# EasyEDA Pro project Cerebro.epro

# Schematic Schematic1
Board Name: ESP-central; Create Date: 2025-05-28; Page Name: P1; Project Name: Sansone; Schematic Name: Schematic1; Update Date: 2025-10-13; Company: EasyEDA.com; Drawn: Maximo Huykman; Page Size: A4; Reviewed: Maximo Huykman; Version: V1.0
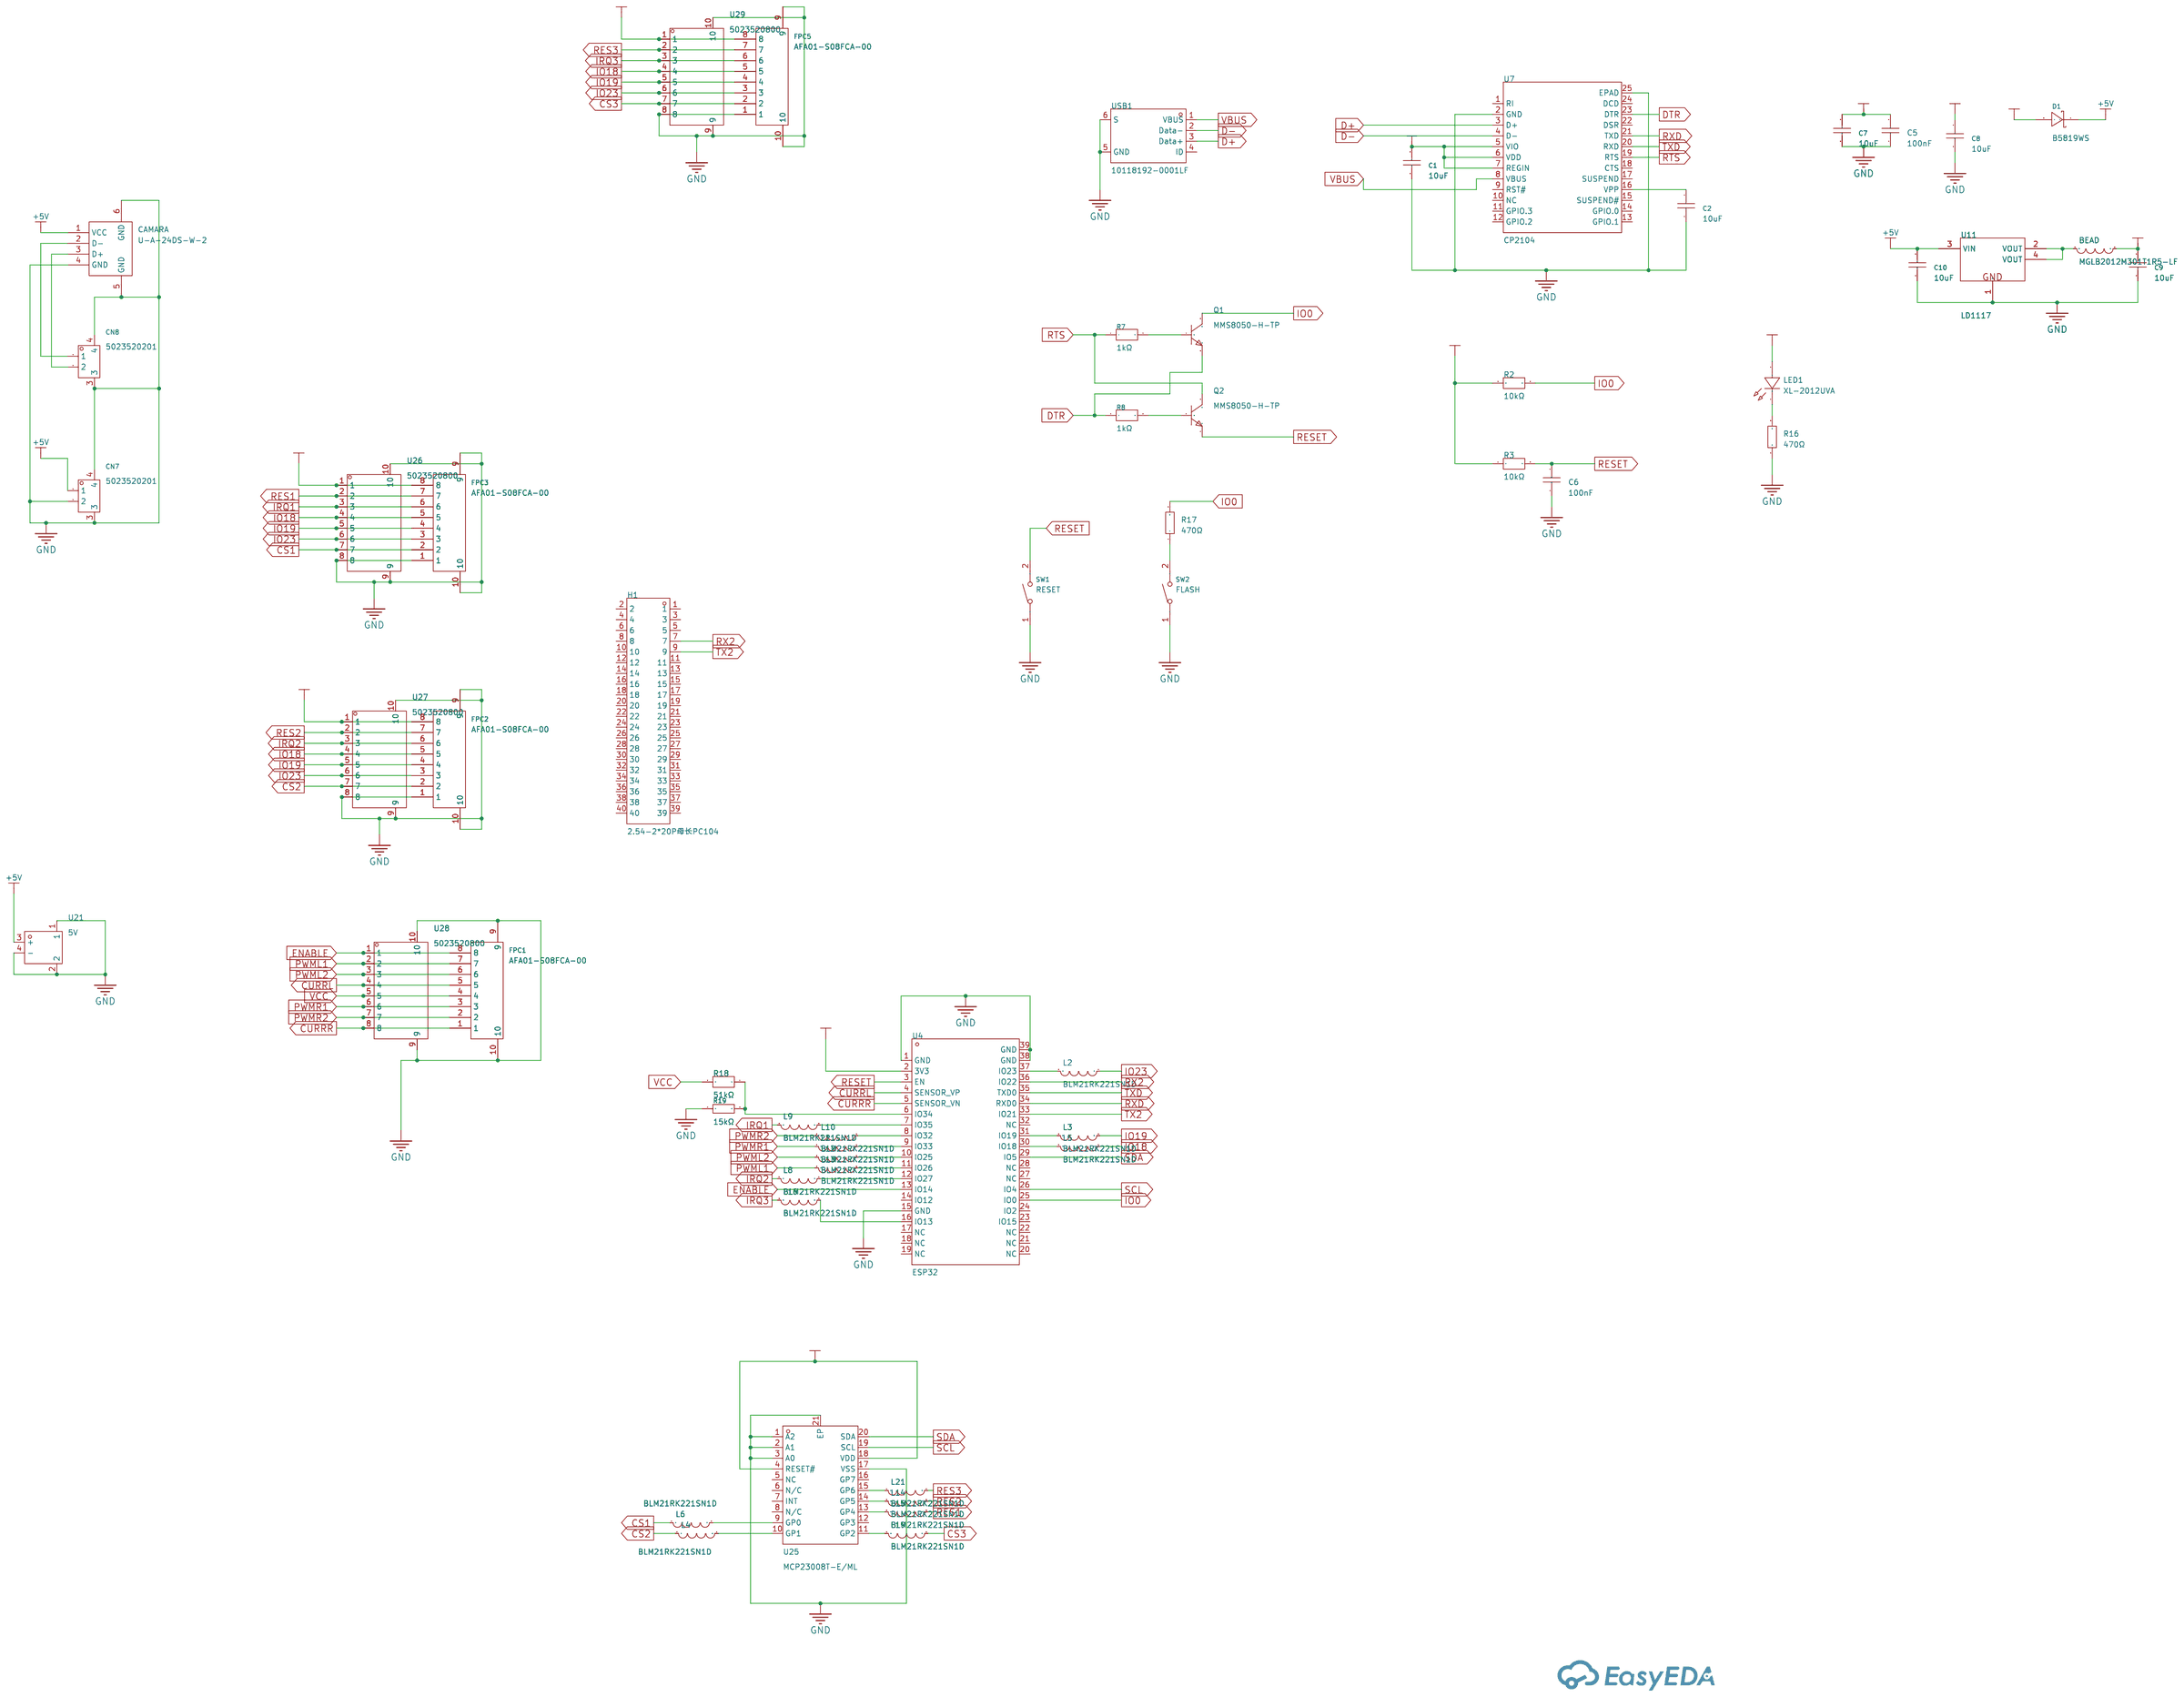
[diagram p0: schematic sheet]

## Parts
BEAD  MGLB2012M301T1R5-LF  [L0805]
C1  10uF  [C0805]
C2  10uF  [C0805]
C5  100nF  [C0805]
C6  100nF  [C0805]
C7  10uF  [C0805]
C8  10uF  [C0805]
C9  10uF  [C0805]
C10  10uF  [C0805]
CAMARA  U-A-24DS-W-2  [USB-A-SMD_U-A-24DS-Y-1]
CN7  5023520201  [CONN-SMD_2P-P2.00_MOLEX_5023520201]
CN8  5023520201  [CONN-SMD_2P-P2.00_MOLEX_5023520201]
D1  B5819WS  [SOD-323_L1.8-W1.3-LS2.5-RD]
FPC1  AFA01-S08FCA-00  [FPC-SMD_8P-P1.00_FGS-XJ-H2.0]
FPC2  AFA01-S08FCA-00  [FPC-SMD_8P-P1.00_FGS-XJ-H2.0]
FPC3  AFA01-S08FCA-00  [FPC-SMD_8P-P1.00_FGS-XJ-H2.0]
FPC5  AFA01-S08FCA-00  [FPC-SMD_8P-P1.00_FGS-XJ-H2.0]
H1  2.54-2*20P母长PC104  [HDR-TH_40P-P2.54-V-F-R2-C20-S2.54-2]
L2  BLM21RK221SN1D  [L0805]
L3  BLM21RK221SN1D  [L0805]
L4  BLM21RK221SN1D  [L0805]
L5  BLM21RK221SN1D  [L0805]
L6  BLM21RK221SN1D  [L0805]
L8  BLM21RK221SN1D  [L0805]
L9  BLM21RK221SN1D  [L0805]
L10  BLM21RK221SN1D  [L0805]
L11  BLM21RK221SN1D  [L0805]
L12  BLM21RK221SN1D  [L0805]
L13  BLM21RK221SN1D  [L0805]
L14  BLM21RK221SN1D  [L0805]
L15  BLM21RK221SN1D  [L0805]
L16  BLM21RK221SN1D  [L0805]
L19  BLM21RK221SN1D  [L0805]
L21  BLM21RK221SN1D  [L0805]
LED1  XL-2012UVA  [LED0805-RD]
Q1  MMS8050-H-TP  [SOT-23-3_L2.9-W1.3-P1.90-LS2.4-BR]
Q2  MMS8050-H-TP  [SOT-23-3_L2.9-W1.3-P1.90-LS2.4-BR]
R2  10kΩ  [R0805]
R3  10kΩ  [R0805]
R7  1kΩ  [R0805]
R8  1kΩ  [R0805]
R16  470Ω  [R0805]
R17  470Ω  [R0805]
R18  51kΩ  [R0805]
R19  15kΩ  [R0805]
SW1  RESET  [SW-SMD_L3.9-W3.0-P4.45]
SW2  FLASH  [SW-SMD_L3.9-W3.0-P4.45]
U4  ESP32  [WIFI-SMD_ESP32-WROVER-IE8MB]
U7  CP2104  [QFN-24_L4.0-W4.0-P0.50-BL-EP2.7]
U11  LD1117  [SOT-223-4_L6.5-W3.5-P2.30-LS7.0-BR]
U21  5V  [TH_2P-XT60PW-F]
U25  MCP23008T-E/ML  [UQFN-20_L4.0-W4.0-P0.50-BL-EP2.7]
U26  5023520800  [CONN-SMD_5023520800]
U27  5023520800  [CONN-SMD_5023520800]
U28  5023520800  [CONN-SMD_5023520800]
U29  5023520800  [CONN-SMD_5023520800]
USB1  10118192-0001LF  [MICRO-USB-SMD_10118192-0001LF_1]

## Library data of the parts
BEAD = MGLB2012M301T1R5-LF: Impedance @ Frequency:300Ω@100MHz Tolerance:±25% Tolerance:±25% DC Resistance(DCR):200mΩ Current Rating:1.5A Number of Circuits:1; LCSC Part Name: 单路 0805磁珠 阻抗300Ω@100MHz; Supplier Part: C281217; Manufacturer: microgate(麦捷科技); Supplier Footprint: 0805; JLCPCB Part Class: Extended Part; Datasheet: https://atta.szlcsc.com/upload/public/pdf/source/20200220/C486341_575042DBDAF338D23816FA38A3E08293.pdf; Supplier: LCSC; Impedance @ Frequency: 300Ω@100MHz; Tolerance: ±25%; DC Resistance(DCR): 200mΩ; Current Rating: 1.5A; Number of Circuits: 1
C1 C2 C7-C10 = CL21A106KPFNNNE: Capacitance: Tolerance:±10% Tolerance:±10% Voltage Rated: Temperature Coefficient:; LCSC Part Name: 10uF ±10% 10V; Supplier Part: C17024; Manufacturer: SAMSUNG(三星); Supplier Footprint: 0805; JLCPCB Part Class: Extended Part; Datasheet: https://atta.szlcsc.com/upload/public/pdf/source/20160218/1457707763339.pdf; Supplier: LCSC; Tolerance: ±10%
C5 C6 = 0805B104J500NT: Capacitance:100nF Tolerance:±5% Tolerance:±5% Voltage Rating:50V Temperature Coefficient:X7R; LCSC Part Name: 100nF ±5% 50V; Supplier Part: C29926; Manufacturer: FH(风华); Supplier Footprint: 0805; JLCPCB Part Class: Extended Part; Datasheet: https://atta.szlcsc.com/upload/public/pdf/source/20200305/C486355_26A10D38EF8C2A5C37091D0039909270.pdf; Supplier: LCSC; Tolerance: ±5%; Voltage Rating: 50V; Temperature Coefficient: X7R
CAMARA = U-A-24DS-W-2: Connector Type:Type-A Standard:USB 2.0 Gender:Female Number of Ports:1 Number of Contacts:4P Mounting Style:卧贴 Current Rating - Power (Max):3.1A Operating Temperature Range:- Operating Temperature Range:-; LCSC Part Name: Type-A 母 卧贴; Supplier Part: C530627; Manufacturer: 韩国韩荣; Supplier Footprint: SMD; JLCPCB Part Class: Extended Part; Datasheet: https://atta.szlcsc.com/upload/public/pdf/source/20210810/FAD12D038DC7272B08E1D85EE0AEEAFD.pdf; Supplier: LCSC; Connector Type: Type-A; Standard: USB 2.0; Gender: Female; Number of Ports: 1; Number of Contacts: 4P; Mounting Style: 卧贴; Current Rating - Power (Max): 3.1A
CN7 CN8 = 5023520201: Pins Structure:1x2P Pitch:2mm Mounting Style:卧贴 Reference Series:- Number of Pins:2P Number of Rows:1 Number of PINs Per Row:2 Row Spacing:- Current Rating (Max):- Contact Material:Copper Alloy Operating Temperature Range:- Operating Temperature Range:-; LCSC Part Name: 1x2P 间距:2mm 卧贴; Supplier Part: C587898; Manufacturer: MOLEX; Supplier Footprint: SMD,P=2mm,卧贴; JLCPCB Part Class: Extended Part; Datasheet: https://atta.szlcsc.com/upload/public/pdf/source/20210916/A33558650610DEBF51F176E4907AAE8E.pdf; Supplier: LCSC; Pins Structure: 1x2P; Pitch: 2mm; Mounting Style: 卧贴; Number of Pins: 2P; Number of Rows: 1; Number of PINs Per Row: 2; Contact Material: Copper Alloy
D1 = B5819WS-TP: Forward Voltage (Vf@If):600mV@1A Reverse Voltage (Vr):40V Average Rectified Current (Io):1A Reverse Leakage Current (Ir):1mA@40V; LCSC Part Name: 电压:40V 电流:1A; Supplier Part: C78734; Manufacturer: MCC(美微科); Supplier Footprint: SOD-323; JLCPCB Part Class: Extended Part; Datasheet: https://atta.szlcsc.com/upload/public/pdf/source/20190308/C78734_7BD7F562D63F05C7B4187010ADA330AA.pdf; Supplier: LCSC; Forward Voltage (Vf@If): 600mV@1A; Reverse Voltage (Vr): 40V; Average Rectified Current (Io): 1A; Reverse Leakage Current (Ir): 1mA@40V
FPC1-FPC3 FPC5 = AFA01-S08FCA-00: Locking Feature:Clamshell Contact Type:Bottom Contact Number of Contacts:8P Pitch:1mm Mounting Type:卧贴 FFC, FCB Thickness:0.3mm FFC, FCB Thickness:0.3mm Height Above Board:2mm; LCSC Part Name: 间距:1mm P数:8P 翻盖式 下接; Supplier Part: C262755; Manufacturer: JS(钜硕电子); Supplier Footprint: SMD,P=1mm,卧贴; JLCPCB Part Class: Extended Part; Datasheet: https://atta.szlcsc.com/upload/public/pdf/source/20180820/C262762_EBECD0847A529CA64FD00527F6604CA9.pdf; Supplier: LCSC; Locking Feature: Clamshell; Contact Type: Bottom Contact; Number of Contacts: 8P; Pitch: 1mm; Mounting Type: 卧贴; FFC, FCB Thickness: 0.3mm; Height Above Board: 2mm
H1 = 2.54-2*20P母长PC104: Holes Structure:2x20P Pitch:2.54mm Row Spacing:2.54mm Mounting Type:Straight Number of Rows:双排 Number of Holes:40P Insulation Height:- Contact Material:Brass Contact Plating:-; LCSC Part Name: 间距:2.54mm 2x20P 直插; Supplier Part: C35165; Manufacturer: BOOMELE(博穆精密); Supplier Footprint: 插件,P=2.54mm; JLCPCB Part Class: Extended Part; Datasheet: https://atta.szlcsc.com/upload/public/pdf/source/20151109/1457707557259.pdf; Supplier: LCSC; Holes Structure: 2x20P; Pitch: 2.54mm; Row Spacing: 2.54mm; Mounting Type: Straight; Number of Rows: 双排; Number of Holes: 40P; Contact Material: Brass
L2-L6 L8-L16 L19 L21 = BLM21RK221SN1D: Impedance @ Frequency:220Ω@100MHz Tolerance:±25% Tolerance:±25% DC Resistance:200mΩ Current Rating:200mA Circuits:1; LCSC Part Name: 单路 0805磁珠 阻抗220Ω@100MHz; Supplier Part: C710511; Manufacturer: muRata(村田); Supplier Footprint: 0805; JLCPCB Part Class: Extended Part; Datasheet: https://atta.szlcsc.com/upload/public/pdf/source/20210606/F3F13CB7AA6F7BFC37924E68B8587F8A.pdf; Supplier: LCSC; Impedance @ Frequency: 220Ω@100MHz; Tolerance: ±25%; DC Resistance: 200mΩ; Current Rating: 200mA; Circuits: 1
LED1 = XL-2012UVA: Emitted Color:Purple Forward Voltage (VF):2.9V~3.5V Forward Voltage (VF):2.9V~3.5V Power Dissipation:75mW Forward Current:- Dominant Wavelength:390nm~429nm Dominant Wavelength:390nm~429nm Lens Color:Colorless transparent lens Viewing Angle:130° Mounting S; Supplier Part: C7371915; Manufacturer: XINGLIGHT(成兴光); Supplier Footprint: 0805; JLCPCB Part Class: Extended Part; Datasheet: https://atta.szlcsc.com/upload/public/pdf/source/20240218/4447D4142362354F41B83550EDB54CB5.pdf; Supplier: LCSC; Emitted Color: Purple; Forward Voltage (VF): 2.9V~3.5V; Power Dissipation: 75mW; Dominant Wavelength: 390nm~429nm; Lens Color: Colorless transparent lens; Viewing Angle: 130°; Mounting Sytle: Positive Stick
Q1 Q2 = MMS8050-H-TP: type: Current - Collector(Ic): Collector - Emitter Voltage VCEO: Pd - Power Dissipation: DC Current Gain:120@50mA,1V DC Current Gain:120@50mA,1V Transition frequency(fT):150MHz Current - Collector Cutoff:100nA Vce Saturation(VCE(sat)):600mV Operating Temp; Supplier Part: C668971; Manufacturer: MCC(美微科); Supplier Footprint: SOT-23; JLCPCB Part Class: Extended Part; Datasheet: https://atta.szlcsc.com/upload/public/pdf/source/20200618/C668971_E8C4278A0C61D2294D468F2197C24659.pdf; Supplier: LCSC; DC Current Gain: 120@50mA,1V; Transition frequency(fT): 150MHz; Current - Collector Cutoff: 100nA; Vce Saturation(VCE(sat)): 600mV; Operating Temperature: -55℃~+150℃@(Tj)
R2 R3 = ERJP06F1002V: Type:Thick Film Resistors Resistance:10kΩ Tolerance:±1% Tolerance:±1% Power(Watts): Overload Voltage (Max):- Temperature Coefficient:±100ppm/℃ Temperature Coefficient:±100ppm/℃ Operating Temperature Range:-55℃~+155℃ Operating Temperature Range:-55℃~+155℃; LCSC Part Name: 10kΩ ±1% 500mW 厚膜电阻; Supplier Part: C543567; Manufacturer: PANASONIC(松下); Supplier Footprint: 0805; JLCPCB Part Class: Extended Part; Datasheet: https://atta.szlcsc.com/upload/public/pdf/source/20200515/C543414_D3FB4A44C151AC19BA141503575FC797.pdf; Supplier: LCSC; Type: Thick Film Resistors; Tolerance: ±1%; Temperature Coefficient: ±100ppm/℃; Operating Temperature Range: -55℃~+155℃
R7 R8 = ERJP06F1001V: Type:Thick Film Resistors Resistance:1kΩ Tolerance:±1% Tolerance:±1% Power(Watts): Overload Voltage (Max):- Temperature Coefficient:±100ppm/℃ Temperature Coefficient:±100ppm/℃ Operating Temperature Range:-55℃~+155℃ Operating Temperature Range:-55℃~+155℃; LCSC Part Name: 1kΩ ±1% 500mW 厚膜电阻; Supplier Part: C441981; Manufacturer: PANASONIC(松下); Supplier Footprint: 0805; JLCPCB Part Class: Extended Part; Supplier: LCSC; Type: Thick Film Resistors; Tolerance: ±1%; Temperature Coefficient: ±100ppm/℃; Operating Temperature Range: -55℃~+155℃
R16 R17 = RC0805FR-07470RL: Type:Thick Film Resistors Resistance: Tolerance:±1% Tolerance:±1% Power(Watts): Overload Voltage (Max): Temperature Coefficient:±100ppm/℃ Temperature Coefficient:±100ppm/℃ Operating Temperature Range:-55℃~+155℃ Operating Temperature Range:-55℃~+155℃; LCSC Part Name: 厚膜电阻 470Ω ±1% 125mW; Supplier Part: C114564; Manufacturer: YAGEO(国巨); Supplier Footprint: 0805; JLCPCB Part Class: Extended Part; Datasheet: https://atta.szlcsc.com/upload/public/pdf/source/20180821/C275644_0D56F95EFF785E7D9A1FEF436B37DA78.pdf; Supplier: LCSC; Type: Thick Film Resistors; Tolerance: ±1%; Temperature Coefficient: ±100ppm/℃; Operating Temperature Range: -55℃~+155℃
R18 = FRC0805F5102TS: Type:Thick Film Resistors Resistance:51kΩ Tolerance:±1% Tolerance:±1% Power(Watts): Overload Voltage (Max): Temperature Coefficient:±100ppm/℃ Temperature Coefficient:±100ppm/℃ Operating Temperature Range:-55℃~+155℃ Operating Temperature Range:-55℃~+155℃; LCSC Part Name: 51kΩ ±1% 125mW 厚膜电阻; Supplier Part: C2933461; Manufacturer: FOJAN(富捷); Supplier Footprint: 0805; JLCPCB Part Class: Extended Part; Datasheet: https://atta.szlcsc.com/upload/public/pdf/source/20211221/925EC7D7225764EE0046F22065062C87.pdf; Supplier: LCSC; Type: Thick Film Resistors; Tolerance: ±1%; Temperature Coefficient: ±100ppm/℃; Operating Temperature Range: -55℃~+155℃
R19 = 0805W8F1502T5E: Type:Thick Film Resistors Resistance:15kΩ Tolerance:±1% Tolerance:±1% Power(Watts): Overload Voltage (Max): Temperature Coefficient:±100ppm/℃ Temperature Coefficient:±100ppm/℃ Operating Temperature Range:-55℃~+155℃ Operating Temperature Range:-55℃~+155℃; LCSC Part Name: 15kΩ ±1% 125mW 厚膜电阻; Supplier Part: C17475; Manufacturer: UNI-ROYAL(厚声); Supplier Footprint: 0805; JLCPCB Part Class: Basic Part; Datasheet: https://atta.szlcsc.com/upload/public/pdf/source/20200306/C422600_1E6D84923E4A46A82E41ADD87F860B5C.pdf; Supplier: LCSC; Type: Thick Film Resistors; Tolerance: ±1%; Temperature Coefficient: ±100ppm/℃; Operating Temperature Range: -55℃~+155℃
SW1 SW2 = TS-1088-AR02016: Circuit:SPST Actuator Style:Round Button Operating Force:160gf Mounting Style:Brick nogging Switch Length:4mm Switch Width:3mm Switch Height:2mm Strike Gundam:不带 Contact Current:50mA Voltage Rating (DC):12V Insulation Resistance:100MΩ Actuator/Cap Color:B; LCSC Part Name: 4*3*2mm 立贴 轻触开关; Supplier Part: C720477; Manufacturer: XUNPU(讯普); Supplier Footprint: SMD; JLCPCB Part Class: Extended Part; Datasheet: https://atta.szlcsc.com/upload/public/pdf/source/20200810/C720475_60D09DD6C54279ADDB2DC25100F1CC11.pdf; Supplier: LCSC; Circuit: SPST; Actuator Style: Round Button; Operating Force: 160gf; Mounting Style: Brick nogging; Switch Length: 4mm; Switch Width: 3mm; Switch Height: 2mm; Strike Gundam: 不带; Contact Current: 50mA; Voltage Rating (DC): 12V; Insulation Resistance: 100MΩ; Actuator/Cap Color: Black; Pin Style: SMDSplicing; Mechanical Life: 10万次; Operating Temperature: -30℃~+80℃
U4 = ESP32-WROVER-E-N8R8: LCSC Part Name: 通用型Wi-Fi+BT+BLE MCU模组; Supplier Part: C2973667; Manufacturer: ESPRESSIF(乐鑫); Supplier Footprint: SMD,18x31.4mm; JLCPCB Part Class: Extended Part; Datasheet: https://atta.szlcsc.com/upload/public/pdf/source/20241030/69A66968DE36EDB45130F1579BF46A5B.pdf; Supplier: LCSC
U7 = CP2104-F03-GMR_C47742: Applications Function:USB to UART Protocol: Supply Voltage:1.8V；3V~3.6V Supply Voltage:1.8V；3V~3.6V Data Rate:2Mbps Operating Temperature:-40℃~+85℃ Operating Temperature:-40℃~+85℃; LCSC Part Name: 单片USB到UART桥接控制器 USB转UART桥接芯片; Supplier Part: C47742; Manufacturer: SKYWORKS/SILICON LABS(芯科); Manufacturer Part: CP2104-F03-GMR; Supplier Footprint: QFN-24-EP(4x4); JLCPCB Part Class: Extended Part; Datasheet: https://atta.szlcsc.com/upload/public/pdf/source/20150504/1457707282429.pdf; Supplier: LCSC; Applications Function: USB to UART; Supply Voltage: 1.8V；3V~3.6V; Data Rate: 2Mbps; Operating Temperature: -40℃~+85℃
U11 = LD1117S33CTR: Output Type:Fixed Maximum Input Voltage:15V Output Voltage:3.3V Output Voltage:3.3V Output Current:800mA Power Supply Rejection Ratio (PSRR):75dB@(120Hz) Dropout Voltage:1.3V@(800mA) standby current:10mA Feature:Thermal Protection(TSD)；Overcurrent Protect; LCSC Part Name: 可调与固定低压降正电压稳压器; Supplier Part: C35879; Manufacturer: ST(意法半导体); Supplier Footprint: SOT-223-4; JLCPCB Part Class: Extended Part; Datasheet: https://atta.szlcsc.com/upload/public/pdf/source/20181022/C283467_00098992BB1D287195B66486CE33A2DD.pdf; Supplier: LCSC; Output Type: Fixed; Maximum Input Voltage: 15V; Output Voltage: 3.3V; Output Current: 800mA; Power Supply Rejection Ratio (PSRR): 75dB@(120Hz); Dropout Voltage: 1.3V@(800mA); standby current: 10mA; Feature: Thermal Protection(TSD)；Overcurrent Protection(OCP); Operating Temperature: -40℃~+125℃; Output Polarity: Positive electrode; Number of Outputs: 1
U21 = XT60PW-F: Power:- Output:- Input:- Size:- Interface:- Type:- Colour:Yellow MaximumCurrent:- Type:卧式插头 RatedVoltage:- Type1:- NumberOfUSBHoles:- InterfaceType:母头 MetalMaterial:- InsulationMaterial:- RatedCurrent:- RecommendedWireGauge:- FlameRetardantGrade:- contact; LCSC Part Name: AMASS(艾迈斯)插头连接器锂电池组充电接口 航模电调卧式焊板 母头 XT60PW-F; Supplier Part: C428722; Manufacturer: AMASS(艾迈斯); JLCPCB Part Class: Extended Part; Datasheet: https://atta.szlcsc.com/upload/public/pdf/source/20190916/C428722_DFF78979486FCB0B58C1FC563067EC88.pdf; Supplier: LCSC; Type: 卧式插头; Colour: Yellow; InterfaceType: 母头
U25 = MCP23008T-E/ML: Supplier Part: C623183; Manufacturer: MICROCHIP(美国微芯); Supplier Footprint: UQFN-20-EP(4x4); JLCPCB Part Class: Extended Part; Datasheet: https://atta.szlcsc.com/upload/public/pdf/source/20200701/C629435_38A7CFBB8D20602DBD0D0F0F2F825F12.pdf; Supplier: LCSC
U26-U29 = 5023520800: Pins Structure:1x8P Pitch:2mm Mounting Style:Horizontal attachment Reference Series:- Number of Pins:8P Number of Rows:1 Number of PINs Per Row:8 Row Spacing:- Contact Material:Copper alloy Contact Plating:Tin; Supplier Part: C114105; Manufacturer: MOLEX; Supplier Footprint: SMD,P=2mm,卧贴; JLCPCB Part Class: Extended Part; Datasheet: https://www.molex.com/content/dam/molex/molex-dot-com/products/automated/en-us/salesdrawingpdf/502/502352/5023520800_sd.pdf?inline\; Supplier: LCSC; Pins Structure: 1x8P; Pitch: 2mm; Mounting Style: Horizontal attachment; Number of Pins: 8P; Number of Rows: 1; Number of PINs Per Row: 8; Contact Material: Copper alloy; Contact Plating: Tin
USB1 = 10118192-0001LF: Connector Type:Micro-B Standard:USB 2.0 Gender:Female Mounting Style:Horizontal attachment Number of Contacts:5P Number of Ports:1 Current Rating - Power (Max):- Operating Temperature Range:-30℃~+80℃ Operating Temperature Range:-30℃~+80℃; LCSC Part Name: Micro-B 母 卧贴; Supplier Part: C132564; Manufacturer: Amphenol; Supplier Footprint: SMD; JLCPCB Part Class: Extended Part; Datasheet: https://atta.szlcsc.com/upload/public/pdf/source/20211129/FE905ED86AF8F92908F94895368BF2E6.pdf; Supplier: LCSC; Connector Type: Micro-B; Standard: USB 2.0; Gender: Female; Mounting Style: Horizontal attachment; Number of Contacts: 5P; Number of Ports: 1; Operating Temperature Range: -30℃~+80℃

## Nets
+3V3: BEAD.1 C1.2 C8.2 C9.2 FPC2.8 FPC3.8 FPC5.8 LED1.2(A) R2.1 R3.1 U4.2(3V3) U7.5(VIO) U7.6(VDD) U7.7(REGIN) U25.4(RESET#) U25.18(VDD) U26.1 U27.1 U29.1
+5V: C10.2 CAMARA.1(VCC) CN7.1 D1.1(K) U11.3(VIN) U21.3(+)
GND: C1.1 C2.1 C5.1 C6.1 C7.1 C8.1 C9.1 C10.1 CAMARA.4(GND) CAMARA.5(GND) CAMARA.6(GND) CN7.2 CN7.3 CN7.4 CN8.3 CN8.4 FPC1.9 FPC1.10 FPC2.1 FPC2.9 FPC2.10 FPC3.1 FPC3.9 FPC3.10 FPC5.1 FPC5.9 FPC5.10 R16.1 R19.1 SW1.1 SW2.1 U4.1(GND) U4.15(GND) U4.38(GND) U4.39(GND) U7.2(GND) U7.25(EPAD) U11.1(GND) U21.1 U21.2 U21.4(-) U25.1(A2) U25.2(A1) U25.3(A0) U25.17(VSS) U25.21(EP) U26.8 U26.9 U26.10 U27.8 U27.9 U27.10 U28.9 U28.10 U29.8 U29.9 U29.10 USB1.5(GND) USB1.6(S)
VBUS: C5.2 C7.2 D1.2(A) U7.8(VBUS) USB1.1(VBUS)
VCC: FPC1.4 R18.2 U28.5
CS1: FPC3.2 L6.1 U26.7
CS2: FPC2.2 L4.1 U27.7
CS3: FPC5.2 L19.1 U29.7
CURRL: FPC1.5 U4.4(SENSOR_VP) U28.4
CURRR: FPC1.1 U4.5(SENSOR_VN) U28.8
D+: U7.3(D+) USB1.3(Data+)
D-: U7.4(D-) USB1.2(Data-)
DTR: Q1.2(E) R8.1 U7.23(DTR)
ENABLE: FPC1.8 U4.13(IO14) U28.1
IO0: Q1.3(C) R2.2 R17.2 U4.25(IO0)
IO18: FPC2.5 FPC3.5 FPC5.5 L5.1 U26.4 U27.4 U29.4
IO19: FPC2.4 FPC3.4 FPC5.4 L3.1 U26.5 U27.5 U29.5
IO23: FPC2.3 FPC3.3 FPC5.3 L2.1 U26.6 U27.6 U29.6
IRQ1: FPC3.6 L9.2 U26.3
IRQ2: FPC2.6 L8.2 U27.3
IRQ3: FPC5.6 L16.2 U29.3
PWML1: FPC1.7 L13.2 U28.2
PWML2: FPC1.6 L12.2 U28.3
PWMR1: FPC1.3 L11.2 U28.6
PWMR2: FPC1.2 L10.2 U28.7
RES1: FPC3.7 L15.2 U26.2
RES2: FPC2.7 L14.2 U27.2
RES3: FPC5.7 L21.2 U29.2
RESET: C6.2 Q2.2(E) R3.2 SW1.2 U4.3(EN)
RTS: Q2.3(C) R7.1 U7.19(RTS)
RX2: H1.7 U4.36(IO22)
RXD: U4.34(RXD0) U7.21(TXD)
SCL: U4.26(IO4) U25.19(SCL)
SDA: U4.29(IO5) U25.20(SDA)
TX2: H1.9 U4.33(IO21)
TXD: U4.35(TXD0) U7.20(RXD)
$1N4161: Q1.1(B) R7.2
$1N4165: Q2.1(B) R8.2
$1N4516: R17.1 SW2.2
$1N4693: C2.2 U7.16(VPP)
$1N5317: LED1.1(K) R16.2
$1N7198: L2.2 U4.37(IO23)
$1N7239: L3.2 U4.31(IO19)
$1N7321: L5.2 U4.30(IO18)
$1N7526: L10.1 U4.8(IO32)
$1N7567: L11.1 U4.9(IO33)
$1N7608: L12.1 U4.10(IO25)
$1N7649: L13.1 U4.11(IO26)
$1N7776: BEAD.2 U11.2(VOUT) U11.4(VOUT)
$1N28858: R18.1 R19.2 U4.6(IO34)
$1N28910: L9.1 U4.7(IO35)
$1N28914: L8.1 U4.12(IO27)
$1N29120: L6.2 U25.9(GP0)
$1N29124: L4.2 U25.10(GP1)
$1N29133: L19.2 U25.11(GP2)
$1N29232: L15.1 U25.13(GP4)
$1N29236: L14.1 U25.14(GP5)
$1N29241: L21.1 U25.15(GP6)
$1N35948: L16.1 U4.16(IO13)
Net-(CAMARA-2): CAMARA.2(D-) CN8.1
Net-(CAMARA-3): CAMARA.3(D+) CN8.2

Not connected (* = marked no-connect by the designer): H1 1 2 3 4 5 6 8 10 11 12 13 14 15 16 17 18 19 20 21 22 23 24 25 26 27 28 29 30 31 32 33 34 35 36 37 38 39 40; U4 14(IO12) 17(NC) 18(NC) 19(NC) 20(NC) 21(NC) 22(NC) 23(IO15) 24(IO2) 27(NC) 28(NC) 32(NC); U7 1(RI) 9(RST#) 10(NC) 11(GPIO.3) 12(GPIO.2) 13(GPIO.1) 14(GPIO.0) 15(SUSPEND#) 17(SUSPEND) 18(CTS) 22(DSR) 24(DCD); U25 5(NC) 6(N/C) 7(INT) 8(N/C) 12(GP3) 16(GP7); USB1 4(ID)

# Board PCB1
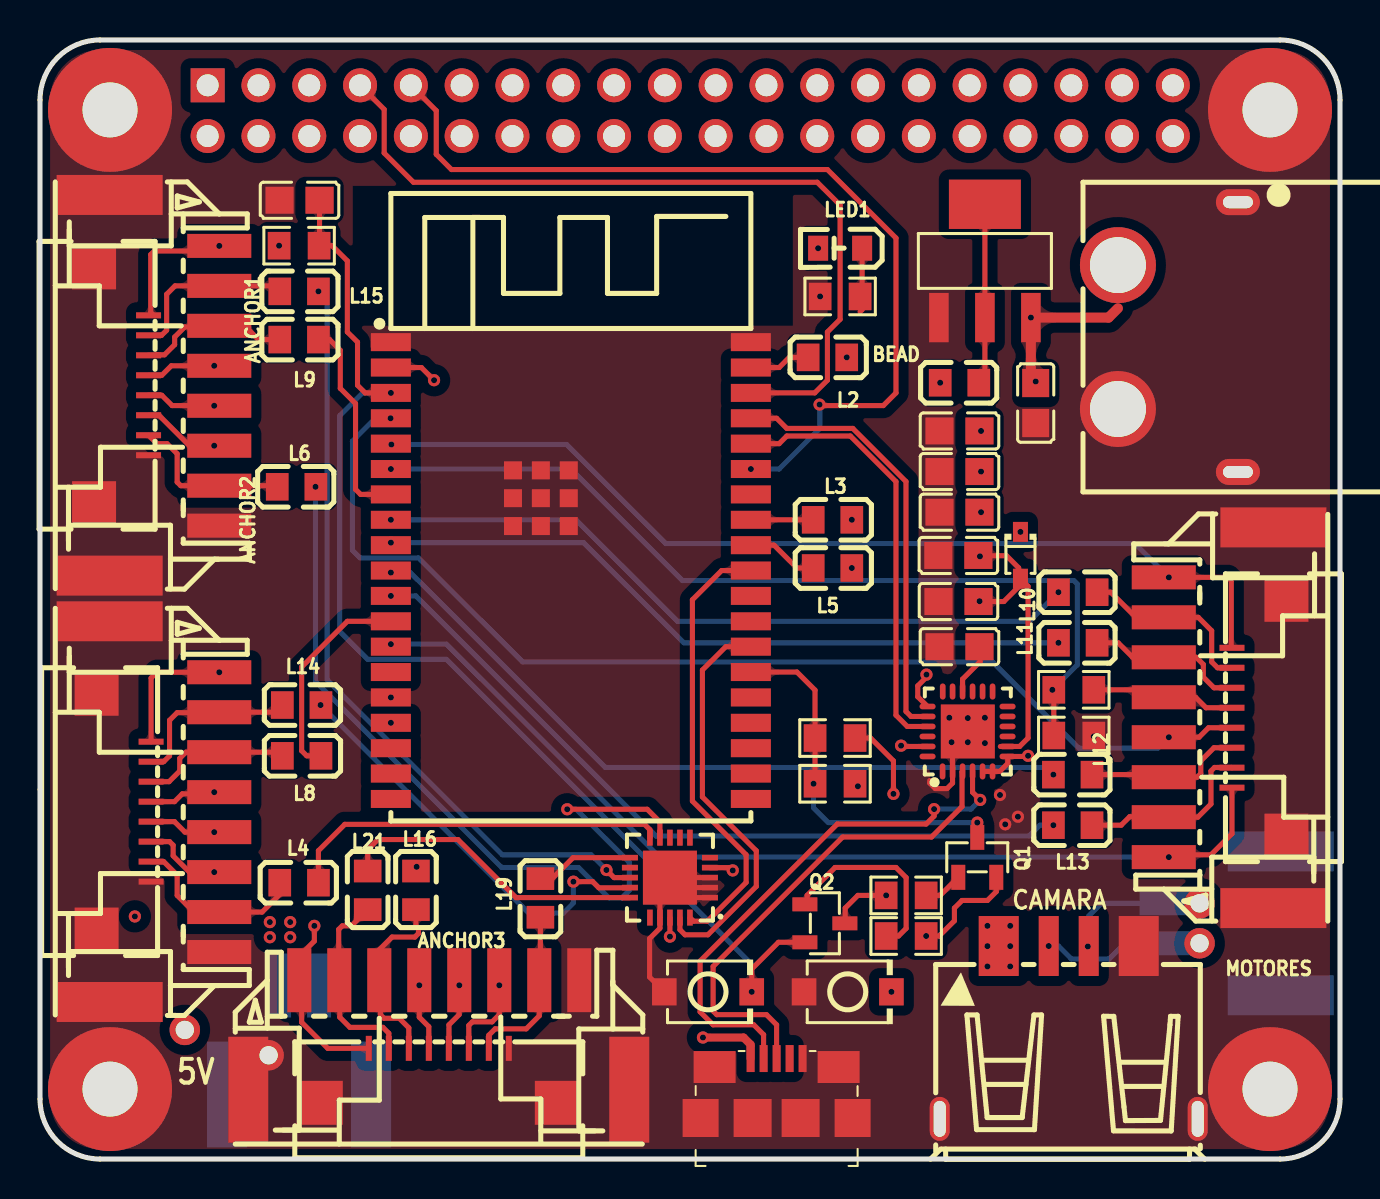
[diagram p1: board, top side]
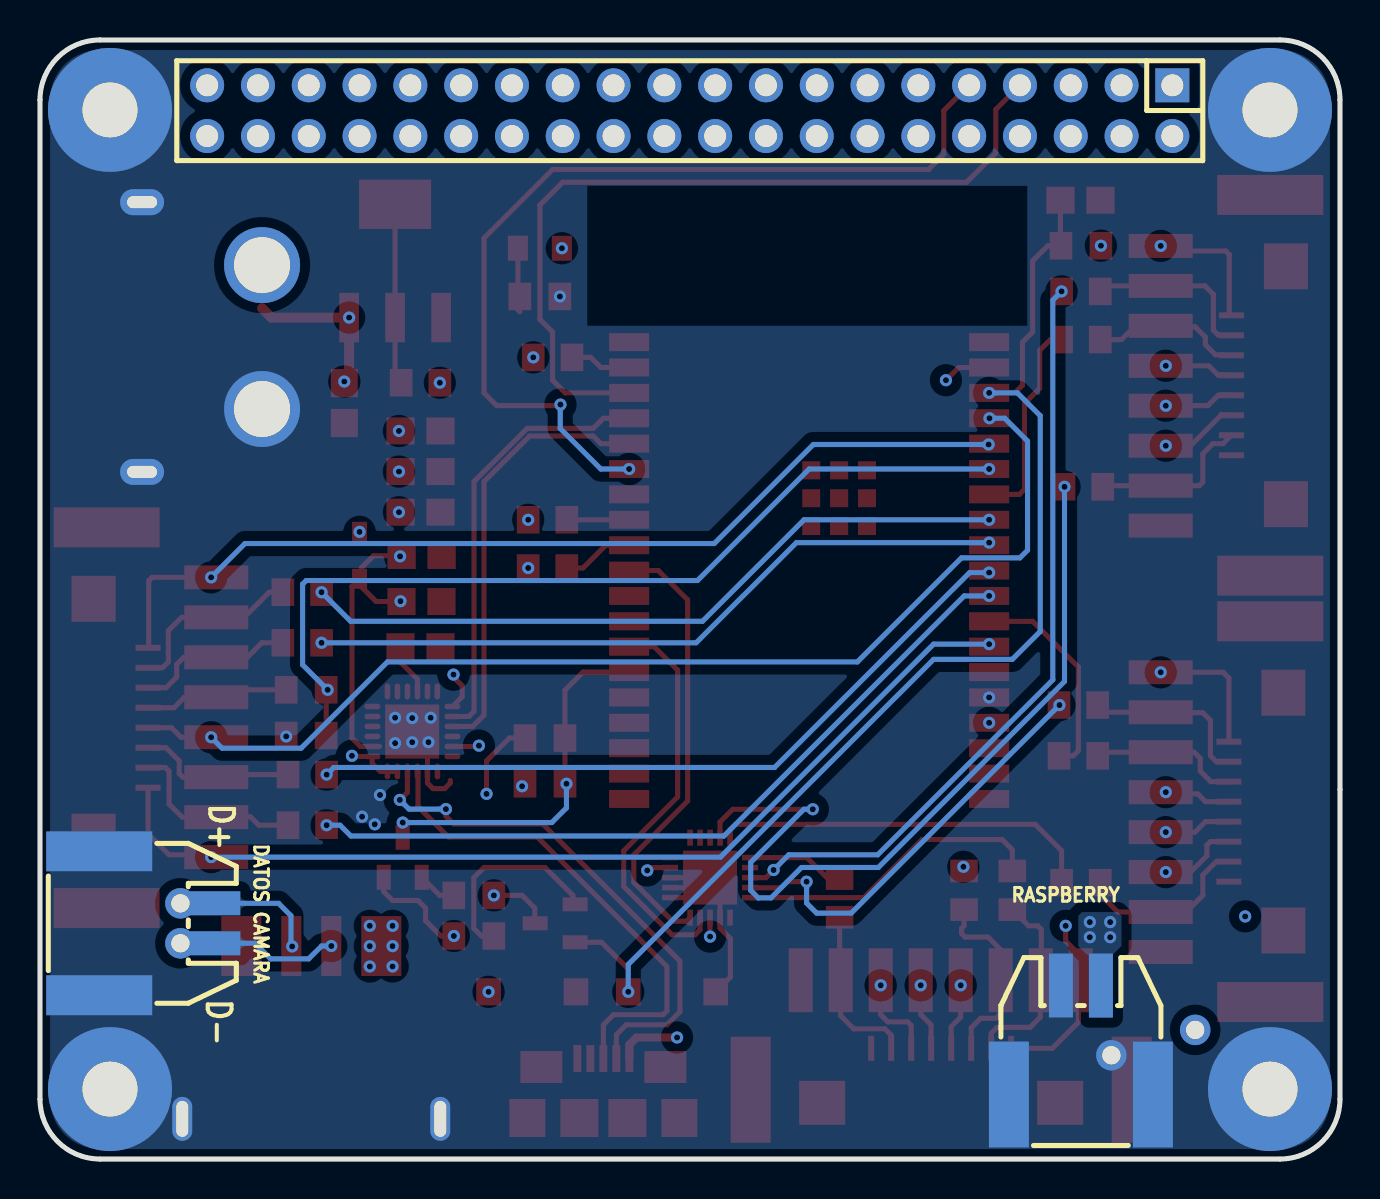
[diagram p2: board, bottom side, seen from below]

Outline 65 x 56 mm; copper layers: Top Layer, GND, PWR, Bottom Layer. Coordinates in mm from the lower left corner of the outline.
Outline path: 0,18.5 0,3 arc(0.88,0.88) 3,0 62,0 arc(64.12,0.88) 65,3 65,53 arc(64.12,55.12) 62,56 3,56 arc(0.88,55.12) 0,53 0,18.5
Stack: Top Layer 0.035mm Outer layer thickness 1oz / Dielectric1 0.2104mm 7628 RC49% 8.6mil / GND 0.0152mm Inner layer thickness / Dielectric2 1.065mm 1.1mm H/HOZ Copper / PWR 0.0152mm Inner layer thickness / Dielectric3 0.2104mm 7628 RC49% 8.6mil / Bottom Layer 0.035mm Outer layer thickness 1oz

## Design rules (mm)
template: Custom Config
spacing copperThickness1oz (default): track to track 0.102, other pairs 0.152 to 0.3
spacing copperThickness2oz: track to track 0.203, other pairs 0.152 to 0.3
track width copperThickness1oz (default): min 0.127, default 0.254, max 2.54
track width copperThickness2oz: min 0.203, default 0.254, max 2.54
differential pair differentialPair (default): width min 0.127, default 0.254, max 2.54; gap min 0.152, default 0.152
via viaSize (default): diameter min 0.5, default 0.61, max 10; hole min 0.3, default 0.305, max 6.3

## Placement (name value [footprint] x y rotation side)
ANCHOR1  -  [CONN-SMD_5023520800]  6.22 38.72 270 top
ANCHOR2  -  [CONN-SMD_5023520800]  6.22 17.38 270 top
ANCHOR3  -  [CONN-SMD_5023520800]  19.94 6.21 0 top
BEAD  MGLB2012M301T1R5-LF  [L0805]  45.97 38.85 0 top
C1  10uF  [C0805]  45.97 32.37 0 top
C2  10uF  [C0805]  45.97 25.64 0 top
C5  100nF  [C0805]  45.92 30.2 0 top
C6  100nF  [C0805]  12.98 47.98 0 top
C7  10uF  [C0805]  45.93 27.9 0 top
C8  10uF  [C0805]  45.97 34.4 0 top
C9  10uF  [C0805]  45.97 36.43 0 top
C10  10uF  [C0805]  49.78 37.83 90 top
CAMARA  U-A-24DS-W-2  [USB-A-SMD_U-A-24DS-Y-1]  51.44 6.33 0 top
D1  B5819WS  [SOD-323_L1.8-W1.3-LS2.5-RD]  49.02 30.21 270 top
DATOS CAMARA  -  [CONN-SMD_2P-P2.00_MOLEX_5023520201]  59.31 11.8 270 bottom
FPC1  AFA01-S08FCA-00  [FPC-SMD_8P-P1.00_FGS-XJ-H2.0]  60.96 22.08 270 top
FPC2  AFA01-S08FCA-00  [FPC-SMD_8P-P1.00_FGS-XJ-H2.0]  4.19 17.38 90 top
FPC3  AFA01-S08FCA-00  [FPC-SMD_8P-P1.00_FGS-XJ-H2.0]  4.06 38.72 90 top
FPC5  AFA01-S08FCA-00  [FPC-SMD_8P-P1.00_FGS-XJ-H2.0]  19.94 4.18 180 top
H1  2.54-2*20P母长PC104  [HDR-TH_40P-P2.54-V-F-R2-C20-S2.54-2]  32.51 52.46 0 bottom
L2  BLM21RK221SN1D  [L0805]  39.37 40.12 180 top
L3  BLM21RK221SN1D  [L0805]  39.62 31.99 180 top
L4  BLM21RK221SN1D  [L0805]  12.95 13.83 0 top
L5  BLM21RK221SN1D  [L0805]  39.62 29.58 180 top
L6  BLM21RK221SN1D  [L0805]  12.83 33.64 0 top
L8  BLM21RK221SN1D  [L0805]  13.08 20.18 180 top
L9  BLM21RK221SN1D  [L0805]  12.95 41.01 180 top
L10  BLM21RK221SN1D  [L0805]  51.89 28.36 0 top
L11  BLM21RK221SN1D  [L0805]  51.89 25.83 0 top
L12  BLM21RK221SN1D  [L0805]  51.64 19.24 0 top
L13  BLM21RK221SN1D  [L0805]  51.64 16.7 0 top
L14  BLM21RK221SN1D  [L0805]  13.08 22.72 180 top
L15  BLM21RK221SN1D  [L0805]  12.95 43.42 180 top
L16  BLM21RK221SN1D  [L0805]  18.8 13.45 270 top
L19  BLM21RK221SN1D  [L0805]  25.02 13.07 90 top
L21  BLM21RK221SN1D  [L0805]  16.38 13.45 270 top
LED1  XL-2012UVA  [LED0805-RD]  40.01 45.58 180 top
MOTORES
  -  [CONN-SMD_5023520800]  58.93 22.08 90 top
NOREF  -  [Pad_e4501]  57.98 12.8 0 top
NOREF#2  -  [Pad_e54]  3.5 3.5 0 top
NOREF#3  -  [Pad_e57]  61.5 52.5 0 top
NOREF#4  -  [Pad_e4505]  11.43 5.19 0 top
NOREF#5  -  [Pad_e55]  3.5 52.5 0 top
NOREF#6  -  [Pad_e4504]  7.24 6.46 0 top
NOREF#7  -  [Pad_e56]  61.5 3.5 0 top
NOREF#8  -  [Pad_e4502]  57.98 10.8 0 top
Q1  MMS8050-H-TP  [SOT-23-3_L2.9-W1.3-P1.90-LS2.4-BR]  46.86 15.1 270 top
Q2  MMS8050-H-TP  [SOT-23-3_L2.9-W1.3-P1.90-LS2.4-BR]  39.24 11.8 180 top
R2  10kΩ  [R0805]  39.75 18.78 180 top
R3  10kΩ  [R0805]  12.95 45.7 0 top
R7  1kΩ  [R0805]  43.31 13.19 0 top
R8  1kΩ  [R0805]  43.31 11.16 180 top
R16  470Ω  [R0805]  40.01 43.16 0 top
R17  470Ω  [R0805]  39.75 21.07 180 top
R18  51kΩ  [R0805]  51.69 23.48 0 top
R19  15kΩ  [R0805]  51.69 21.19 180 top
RASPBERRY  -  [CONN-SMD_2P-P2.00_MOLEX_5023520201]  12.95 5.95 180 bottom
SW1  RESET  [SW-SMD_L3.9-W3.0-P4.45]  33.4 8.37 0 top
SW2  FLASH  [SW-SMD_L3.9-W3.0-P4.45]  40.39 8.37 0 top
U4  ESP32  [WIFI-SMD_ESP32-WROVER-IE8MB]  26.54 29.45 0 top
U7  CP2104  [QFN-24_L4.0-W4.0-P0.50-BL-EP2.7]  46.38 21.4 0 top
U11  LD1117  [SOT-223-4_L6.5-W3.5-P2.30-LS7.0-BR]  47.24 44.94 270 top
U21  5V  [TH_2P-XT60PW-F]  56.9 41.13 270 top
U25  MCP23008T-E/ML  [UQFN-20_L4.0-W4.0-P0.50-BL-EP2.7]  31.5 14.08 90 top
USB1  10118192-0001LF  [MICRO-USB-SMD_10118192-0001LF_1]  36.83 3.54 0 top

## Footprints (pads in the part's own frame, mm; a bottom-side part is the same pattern mirrored in y, then rotated)
C0805
  rect 1.41x1.35 smd: 1(-1,0) 2(1,0)
CONN-SMD_2P-P2.00_MOLEX_5023520201
  rect 1.2x3.2 smd: 1(1,2.728) 2(-1,2.728)
  rect 2x5.3 smd: 3(-3.6,-2.728) 4(3.6,-2.728)
CONN-SMD_5023520800
  rect 1.2x3.2 smd: 1(-6.975,2.74) 2(-4.975,2.74) 3(-2.975,2.74) 4(-0.975,2.74) 5(1.025,2.74) 6(3.025,2.74) 7(5.025,2.74) 8(7.025,2.74)
  rect 2x5.3 smd: 9(9.525,-2.74) 10(-9.525,-2.74)
FPC-SMD_8P-P1.00_FGS-XJ-H2.0
  rect 0.3x1.25 smd: 1(-3.5,-1.363) 2(-2.5,-1.363) 3(-1.5,-1.363) 4(-0.5,-1.363) 5(0.5,-1.363) 6(1.5,-1.363) 7(2.5,-1.363) 8(3.5,-1.363)
  rect 2.3x2.2 smd: 9(-5.95,1.363) 10(5.95,1.363)
HDR-TH_40P-P2.54-V-F-R2-C20-S2.54-2
  rect 1.7x1.7 hole 1.1: 1(-24.13,-1.27)
  round 1.7 hole 1.1: 2(-24.13,1.27) 3(-21.59,-1.27) 4(-21.59,1.27) 5(-19.05,-1.27) 6(-19.05,1.27) 7(-16.51,-1.27) 8(-16.51,1.27) 9(-13.97,-1.27) 10(-13.97,1.27) 11(-11.43,-1.27) 12(-11.43,1.27) 13(-8.89,-1.27) 14(-8.89,1.27) 15(-6.35,-1.27) 16(-6.35,1.27) 17(-3.81,-1.27) 18(-3.81,1.27) 19(-1.27,-1.27) 20(-1.27,1.27) 21(1.27,-1.27) 22(1.27,1.27) 23(3.81,-1.27) 24(3.81,1.27) 25(6.35,-1.27) 26(6.35,1.27) 27(8.89,-1.27) 28(8.89,1.27) 29(11.43,-1.27) 30(11.43,1.27) 31(13.97,-1.27) 32(13.97,1.27) 33(16.51,-1.27) 34(16.51,1.27) 35(19.05,-1.27) 36(19.05,1.27) 37(21.59,-1.27) 38(21.59,1.27) 39(24.13,-1.27) 40(24.13,1.27)
L0805
  rect 1.133x1.377 smd: 1(-0.966,0) 2(0.966,0)
LED0805-RD
  rect 1x1.25 smd: 1(-1.1,0) 2(1.1,0)
MICRO-USB-SMD_10118192-0001LF_1
  rect 0.4x1.35 smd: 1(-1.3,1.488) 2(-0.65,1.488) 3(0,1.488) 4(0.65,1.488) 5(1.3,1.488)
  rect 1.8x1.9 smd: 6(-3.8,-1.488) 6(3.8,-1.488)
  rect 2.1x1.6 smd: 6(-3.1,1.063) 6(3.1,1.063)
  rect 1.9x1.9 smd: 6(-1.199,-1.488) 6(1.199,-1.488)
Pad_e54
  round 6.2 hole 2.75: 2(0,0)
Pad_e55
  round 6.2 hole 2.75: 2(0,0)
Pad_e56
  round 6.2 hole 2.75: 2(0,0)
Pad_e57
  round 6.2 hole 2.75: 2(0,0)
Pad_e4501
  round 1.524 hole 0.914: 1(0,0)
Pad_e4502
  round 1.524 hole 0.914: 2(0,0)
Pad_e4504
  round 1.524 hole 0.914: 1(0,0)
Pad_e4505
  round 1.524 hole 0.914: 2(0,0)
QFN-24_L4.0-W4.0-P0.50-BL-EP2.7
  oval 0.28x0.8 smd: 1(-1.25,-2) 2(-0.75,-2) 3(-0.25,-2) 4(0.25,-2) 5(0.75,-2) 6(1.25,-2) 13(1.25,2) 14(0.75,2) 15(0.25,2) 16(-0.25,2) 17(-0.75,2) 18(-1.242,2)
  oval 0.8x0.28 smd: 7(2,-1.25) 8(2,-0.75) 9(2,-0.25) 10(2,0.25) 11(2,0.75) 12(2,1.25) 19(-2,1.25) 20(-2,0.75) 21(-2,0.25) 22(-2,-0.25) 23(-2,-0.75) 24(-2,-1.25)
  rect 2.7x2.7 smd: 25(0.013,0)
R0805
  rect 1.133x1.377 smd: 1(-1,0) 2(1,0)
SOD-323_L1.8-W1.3-LS2.5-RD
  rect 1x0.75 smd: 1(-1.173,0) 2(1.173,0)
SOT-23-3_L2.9-W1.3-P1.90-LS2.4-BR
  rect 1.25x0.7 smd: 1(1,-0.95) 2(1,0.95) 3(-1,0)
SOT-223-4_L6.5-W3.5-P2.30-LS7.0-BR
  rect 2.47x0.98 smd: 1(2.835,-2.3) 2(2.835,0) 3(2.835,2.3)
  rect 2.47x3.6 smd: 4(-2.835,0)
SW-SMD_L3.9-W3.0-P4.45
  rect 1.23x1.36 smd: 1(-2.185,0) 2(2.185,0)
TH_2P-XT60PW-F
  oval 1.3x2.2 hole 0.6x1.5: 1(-6.75,3) 2(6.75,3)
  round 3.8 hole 2.8: 3(-3.6,-3) 4(3.6,-3)
UQFN-20_L4.0-W4.0-P0.50-BL-EP2.7
  rect 0.28x0.8 smd: 1(-1,-2) 2(-0.5,-2) 3(0,-2) 4(0.5,-2) 5(1,-2) 11(1,2) 12(0.5,2) 13(0,2) 14(-0.5,2) 15(-1,2)
  rect 0.8x0.28 smd: 6(2,-1) 7(2,-0.5) 8(2,0) 9(2,0.5) 10(2,1) 16(-2,1) 17(-2,0.5) 18(-2,0) 19(-2,-0.5) 20(-2,-1)
  rect 2.7x2.7 smd: 21(0,0)
USB-A-SMD_U-A-24DS-Y-1
  rect 2x3 smd: 1(-3.5,4.325) 4(3.5,4.325)
  rect 1x3 smd: 2(-1,4.325) 3(1,4.325)
  oval 1x2.2 hole 0.6x1.8: 5(-6.45,-4.325) 6(6.45,-4.325)
WIFI-SMD_ESP32-WROVER-IE8MB
  rect 2x0.9 smd: 1(-9,11.43) 2(-9,10.16) 3(-9,8.89) 4(-9,7.62) 5(-9,6.35) 6(-9,5.08) 7(-9,3.81) 8(-9,2.54) 9(-9,1.27) 10(-9,0) 11(-9,-1.27) 12(-9,-2.54) 13(-9,-3.81) 14(-9,-5.08) 15(-9,-6.35) 16(-9,-7.62) 17(-9,-8.89) 18(-9,-10.16) 19(-9,-11.43) 20(9,-11.43) 21(9,-10.16) 22(9,-8.89) 23(9,-7.62) 24(9,-6.35) 25(9,-5.08) 26(9,-3.81) 27(9,-2.54) 28(9,-1.27) 29(9,0) 30(9,1.27) 31(9,2.54) 32(9,3.81) 33(9,5.08) 34(9,6.35) 35(9,7.62) 36(9,8.89) 37(9,10.16) 38(9,11.43)
  rect 0.9x0.9 smd: 39(-2.895,5.015) 39(-2.895,3.62) 39(-2.895,2.225) 39(-1.5,5.015) 39(-1.5,3.62) 39(-1.5,2.225) 39(-0.105,5.015) 39(-0.105,3.62) 39(-0.105,2.225)

## Nets
+3V3: ANCHOR1.1 ANCHOR2.1 ANCHOR3.1 BEAD.1 C1.2 C8.2 C9.2 FPC2.8 FPC3.8 FPC5.8 LED1.2 R2.1 R3.1 U4.2 U7.5 U7.6 U7.7 U25.4 U25.18
+5V: C10.2 CAMARA.1 D1.1 NOREF#6.1 RASPBERRY.1 U11.3 U21.3
GND: ANCHOR1.8 ANCHOR1.9 ANCHOR1.10 ANCHOR2.8 ANCHOR2.9 ANCHOR2.10 ANCHOR3.8 ANCHOR3.9 ANCHOR3.10 C1.1 C2.1 C5.1 C6.1 C7.1 C8.1 C9.1 C10.1 CAMARA.4 CAMARA.5 CAMARA.6 DATOS CAMARA.3 DATOS CAMARA.4 FPC1.9 FPC1.10 FPC2.1 FPC2.9 FPC2.10 FPC3.1 FPC3.9 FPC3.10 FPC5.1 FPC5.9 FPC5.10 MOTORES
.9 MOTORES
.10 NOREF#2.2 NOREF#3.2 NOREF#4.2 NOREF#5.2 NOREF#7.2 R16.1 R19.1 RASPBERRY.2 RASPBERRY.3 RASPBERRY.4 SW1.1 SW2.1 U4.1 U4.15 U4.38 U4.39 U7.2 U7.25 U11.1 U21.1 U21.2 U21.4 U25.1 U25.2 U25.3 U25.17 U25.21 USB1.5 USB1.6
VBUS: C5.2 C7.2 D1.2 U7.8 USB1.1
VCC: FPC1.4 MOTORES
.5 R18.2
CS1: ANCHOR1.7 FPC3.2 L6.1
CS2: ANCHOR2.7 FPC2.2 L4.1
CS3: ANCHOR3.7 FPC5.2 L19.1
CURRL: FPC1.5 MOTORES
.4 U4.4
CURRR: FPC1.1 MOTORES
.8 U4.5
D+: U7.3 USB1.3
D-: U7.4 USB1.2
DTR: Q1.2 R8.1 U7.23
ENABLE: FPC1.8 MOTORES
.1 U4.13
IO0: Q1.3 R2.2 R17.2 U4.25
IO18: ANCHOR1.4 ANCHOR2.4 ANCHOR3.4 FPC2.5 FPC3.5 FPC5.5 L5.1
IO19: ANCHOR1.5 ANCHOR2.5 ANCHOR3.5 FPC2.4 FPC3.4 FPC5.4 L3.1
IO23: ANCHOR1.6 ANCHOR2.6 ANCHOR3.6 FPC2.3 FPC3.3 FPC5.3 L2.1
IRQ1: ANCHOR1.3 FPC3.6 L9.2
IRQ2: ANCHOR2.3 FPC2.6 L8.2
IRQ3: ANCHOR3.3 FPC5.6 L16.2
PWML1: FPC1.7 L13.2 MOTORES
.2
PWML2: FPC1.6 L12.2 MOTORES
.3
PWMR1: FPC1.3 L11.2 MOTORES
.6
PWMR2: FPC1.2 L10.2 MOTORES
.7
RES1: ANCHOR1.2 FPC3.7 L15.2
RES2: ANCHOR2.2 FPC2.7 L14.2
RES3: ANCHOR3.2 FPC5.7 L21.2
RESET: C6.2 Q2.2 R3.2 SW1.2 U4.3
RTS: Q2.3 R7.1 U7.19
RX2: H1.7 U4.36
RXD: U4.34 U7.21
SCL: U4.26 U25.19
SDA: U4.29 U25.20
TX2: H1.9 U4.33
TXD: U4.35 U7.20
$1N4161: Q1.1 R7.2
$1N4165: Q2.1 R8.2
$1N4516: R17.1 SW2.2
$1N4693: C2.2 U7.16
$1N5317: LED1.1 R16.2
$1N7198: L2.2 U4.37
$1N7239: L3.2 U4.31
$1N7321: L5.2 U4.30
$1N7526: L10.1 U4.8
$1N7567: L11.1 U4.9
$1N7608: L12.1 U4.10
$1N7649: L13.1 U4.11
$1N7776: BEAD.2 U11.2 U11.4
$1N14853: CAMARA.2 DATOS CAMARA.1 NOREF#8.2
$1N14860: CAMARA.3 DATOS CAMARA.2 NOREF.1
$1N28858: R18.1 R19.2 U4.6
$1N28910: L9.1 U4.7
$1N28914: L8.1 U4.12
$1N29120: L6.2 U25.9
$1N29124: L4.2 U25.10
$1N29133: L19.2 U25.11
$1N29232: L15.1 U25.13
$1N29236: L14.1 U25.14
$1N29241: L21.1 U25.15
$1N35948: L16.1 U4.16

Pads without a net: H1 1 2 3 4 5 6 8 10 11 12 13 14 15 16 17 18 19 20 21 22 23 24 25 26 27 28 29 30 31 32 33 34 35 36 37 38 39 40; U4 14 17 18 19 20 21 22 23 24 27 28 32; U7 1 9 10 11 12 13 14 15 17 18 22 24; U25 5 6 7 8 12 16; USB1 4

## Via types
v1: diameter 0.61, hole 0.305, Top Layer to Bottom Layer, 95 vias

## Routing (per net, layer and track width the routed paths; a pad name or vN(x,y) marks a point on that pad's centre or on a via; arc(x,y) is an arc through that point)
+3V3: length 69
  Top Layer w0.254: U7.5 U7.6 47.99,19.4 48.39,19.8 48.39,20.14 U7.7 49.37,20.15 v1(49.4,20.18) ; U25.4 34.5,14.58 v1(34.64,14.44) ; 5.68,42.22 5.54,42.36 5.54,45.26 5.72,45.44 8.46,45.44 8.71,45.69 ; v1(19.7,38.97) 19.07,39.61 U4.2 ; v1(31.5,11.13) U25.18 ; FPC2.8 5.55,24.07 5.84,24.36 v1(8.96,24.36) ; FPC5.8 14.39,5.54 13.08,6.84 13.08,8.83 ANCHOR3.1 12.96,10.15 13.72,10.91 v1(13.72,11.67)
  PWR w0.254: v1(4.74,12.14) 5.21,11.67 5.21,11.03 6.48,9.76 13.34,9.76 13.72,10.14 v1(13.72,11.67) ; v1(31.5,11.13) 31.5,12.43 33.51,14.44 v1(34.64,14.44) 37.7,14.44 40.89,17.64 v1(40.89,18.65) ; v1(49.4,20.18) 49.53,20.3 49.53,20.81 49.78,21.07 49.78,29.64 v1(47.05,32.37)
  vias: v1(8.96,45.69) v1(11.95,45.7) v1(38.91,45.58) v1(45.01,38.85) v1(47.05,36.43) v1(47.05,34.4)
+5V: length 7.8
  Top Layer w0.5: 53.9,42.57 53.43,42.11 v1(49.54,42.11) 49.54,39.15 v1(49.78,38.91)
  vias: v1(11.49,11.86) v1(11.49,11.1) v1(12.51,11.86) v1(12.51,11.1) v1(47.37,11.67) v1(47.37,10.65) v1(47.37,9.64) v1(48.51,11.67) v1(48.51,10.65) v1(48.51,9.64) v1(49.02,31.38)
GND: length 15.9
  Top Layer w0.254: U25.3 U25.21 31,13.58 U25.17 31,11.55 30.48,11.03 30.48,9.1 SW1.1 ; U25.2 32,13.58 32.5,13.08 U25.1 ; 45.25,21.4 45.25,21.19 v1(45.58,20.86) 45.63,20.81 U7.2 45.63,18.81 45.35,18.54 44.76,18.54 44.48,18.82 44.48,18.94
  vias: v1(17.54,23.1) v1(39.01,43.16) v1(45.47,22.08) v1(46.39,22.07) v1(46.39,20.86) v1(47.24,22.08) v1(47.24,20.81) v1(48,18.22) v1(48.26,16.75) v1(48.9,17.13) v1(52.69,21.15)
VBUS: length 50.6
  Top Layer w0.254: 47,27.9 48.19,27.9 48.93,28.64 48.93,29.58 48.33,30.19 46.93,30.19 C5.2 ; 48.02,20.65 48.98,20.65 49.4,21.07 49.4,28.66 D1.2
  Top Layer w0.4: USB1.1 35.53,5.73 35.18,6.08 v1(33.15,6.08)
  PWR w1: v1(33.15,6.08) 33.15,7.31 45.31,19.47 47.25,19.47 48.51,20.73 48.51,26.38 v1(46.98,27.91) 46.98,30.14 v1(47,30.16)
VCC: length 7.5
  Top Layer w0.254: MOTORES
.5 56.44,23.11 ; 56.44,23.11 56.07,23.48 R18.2 ; 56.44,23.11 57.78,23.11 58.3,22.58 FPC1.4
CS1: length 8.3
  Top Layer w0.254: L6.1 11.81,33.69 7.04,33.69 6.86,33.87 6.86,35.29 6.35,35.8 5.85,35.8 FPC3.2
CS2: length 9
  Top Layer w0.254: L4.1 11.99,13.24 11.1,12.36 7.69,12.36 6.86,13.19 6.86,14.21 6.18,14.88 FPC2.2
CS3: length 8.8
  Top Layer w0.254: FPC5.2 22.44,6.2 22.76,6.51 24.31,6.51 24.96,7.17 24.96,8.69 ; 24.96,8.69 25.02,8.75 L19.1 ; 24.96,8.69 ANCHOR3.7
CURRL: length 56.3
  Top Layer w0.254: v1(56.44,21.11) 57.95,21.11 58.43,21.58 FPC1.5
  Bottom Layer w0.254: v1(17.53,37.07) 16.76,37.07 15.62,35.93 15.62,30.46 16,30.08 18.92,30.08 24.13,24.88 47.63,24.88 51.94,20.56 55.89,20.56 v1(56.44,21.11)
CURRR: length 48.2
  Top Layer w0.254: v1(56.44,29.11) 59.4,29.11 59.56,28.94 59.56,25.68 59.47,25.58
  Bottom Layer w0.254: v1(17.57,35.76) 26.33,35.76 31.29,30.8 54.75,30.8 v1(56.44,29.11)
D+: length 24.9
  Top Layer w0.254: U7.3 46.1,19.37 46.1,17.64 44.58,16.11 40.13,16.11 33.66,9.64 33.66,7.41 33.84,7.22 36.32,7.22 36.83,6.72 USB1.3
D-: length 26.5
  Top Layer w0.254: v1(47.01,17.97) 46.63,18.35 U7.4 ; v1(44.7,17.51) 44.7,17.16 44.31,16.76 39.86,16.76 33.01,9.91 33.01,7.37 33.66,6.72 35.69,6.72 36.18,6.22 USB1.2
  Bottom Layer w0.254: v1(44.7,17.51) 46.55,17.51 v1(47.01,17.97)
DTR: length 16.9
  Top Layer w0.254: v1(44.31,11.16) 44.96,11.16 45.72,11.92 45.72,12.56 46.1,12.94 47.37,12.94 47.81,13.38 Q1.2 ; v1(43.05,20.69) 43.09,20.65 U7.23
  GND w0.254: v1(43.05,20.69) 44.12,19.62 44.12,12 44.31,11.81 v1(44.31,11.16)
ENABLE: length 49.3
  Top Layer w0.254: FPC1.8 59.6,16.28 58.55,15.22 56.56,15.22 v1(56.44,15.11)
  Bottom Layer w0.254: v1(56.44,15.11) 30.98,15.11 20.32,25.77 v1(17.54,25.77)
IO0: length 18.7
  Top Layer w0.254: U4.25 37.85,24.37 38.75,23.46 R17.2 38.75,18.86 v1(38.68,18.78) ; v1(46.86,16.84) Q1.3
  Bottom Layer w0.254: v1(38.68,18.78) 38.68,17.57 39.41,16.84 v1(46.86,16.84)
IO18: length 100.6
  Top Layer w0.254: v1(8.71,18.36) 8.62,18.27 7.11,18.27 6.72,17.88 FPC2.5 ; FPC5.5 19.44,6.62 18.96,7.1 v1(18.96,8.69) ; FPC3.5 6.09,39.22 6.56,39.69 8.96,39.69
  GND w0.254: 6.86,18.36 v1(8.71,18.36) ; 6.86,18.36 6.86,13.32 7.37,12.81 18.29,12.81 18.96,12.14 v1(18.96,8.69) ; 6.86,18.36 5.59,19.63 5.59,37.83 7.45,39.69 v1(8.71,39.69) 16.8,39.69 17.3,40.19 17.79,40.19 18.28,39.69 37.89,39.69 42.55,35.04 42.55,30.08 42.04,29.58 v1(40.59,29.58)
IO19: length 91.3
  Top Layer w0.254: FPC2.4 6.72,16.88 7.25,16.36 8.96,16.36 ; v1(8.71,37.69) 8.7,37.7 6.6,37.7 6.09,38.22 FPC3.4 ; FPC5.4 20.45,5.55 20.45,6.72 20.96,7.22 20.96,8.68 v1(20.96,8.69)
  GND w0.254: v1(20.96,8.69) 20.96,11.66 19.3,13.32 8.64,13.32 7.87,14.08 7.87,15.86 8.37,16.36 v1(8.71,16.36) 9.14,16.36 9.4,16.61 9.4,18.65 6.48,21.57 6.48,37.07 7.1,37.69 v1(8.71,37.69) 37.6,37.69 40.77,34.53 40.77,32.17 v1(40.59,31.99)
IO23: length 96.7
  Top Layer w0.254: v1(8.71,14.36) 7.47,14.36 6.66,15.17 6.66,15.7 6.48,15.88 FPC2.3 ; FPC3.3 5.95,37.22 7.47,35.69 8.96,35.69 ; v1(22.96,8.69) 22.96,7.22 22.61,6.86 21.62,6.86 21.44,6.69 FPC5.3
  GND w0.254: 9.87,14.36 v1(8.71,14.36) ; 9.87,14.36 10.41,13.83 20.19,13.83 22.96,11.06 22.96,11.01 ; 9.87,14.36 9.87,19.19 7.24,21.83 7.24,34.1 8.71,35.57 v1(8.71,35.69) ; v1(22.96,8.69) 22.96,11.01 ; 22.96,11.01 24.51,12.56 31.5,12.56 43.56,24.62 43.56,36.18 40.34,39.4 v1(40.34,40.12)
IRQ1: length 7.7
  Top Layer w0.254: L9.2 10.92,41.01 10.23,41.69 8.96,41.69 8.91,41.64 7.24,41.64 6.73,41.13 6.73,40.75 6.22,40.24 5.84,40.24 5.82,40.22 FPC3.6
IRQ2: length 7.6
  Top Layer w0.254: FPC2.6 6.45,18.88 6.99,19.42 6.99,20.05 7.29,20.36 11.93,20.36 12.12,20.18
IRQ3: length 9.5
  Top Layer w0.254: FPC5.6 18.44,6.56 17.96,7.04 17.2,7.04 17.02,7.22 17.02,8.89 ANCHOR3.3 16.96,10.47 17.6,11.11 18.74,11.11 18.92,11.29 18.92,11.54 18.8,11.67 L16.2
PWML1: length 9.4
  Top Layer w0.254: L13.2 54.06,16.7 54.48,17.13 56.42,17.13 56.44,17.11 ; 56.44,17.11 MOTORES
.2 ; 56.44,17.11 57.89,17.11 58.55,17.76 58.55,19.42 58.73,19.6 59.59,19.6 FPC1.7
PWML2: length 8.3
  Top Layer w0.254: 56.44,19.11 56.31,19.24 L12.2 ; 56.44,19.11 MOTORES
.3 ; 56.44,19.11 57.86,19.11 58.04,19.29 58.04,19.92 58.7,20.58 FPC1.6
PWMR1: length 8
  Top Layer w0.254: L11.2 53.91,25.83 54.63,25.11 MOTORES
.6 57.81,25.11 58.17,24.75 58.17,24.11 58.7,23.58 FPC1.3
PWMR2: length 9.2
  Top Layer w0.254: FPC1.2 58.88,24.58 58.58,24.88 58.58,26.44 57.91,27.11 MOTORES
.7 54.79,27.11 53.54,28.36 L10.2
RES1: length 8.5
  Top Layer w0.254: L15.2 11.71,43.69 6.75,43.69 6.33,43.27 6.33,41.47 6.08,41.22 5.68,41.22
RES2: length 8.8
  Top Layer w0.254: 12.12,22.72 11.76,22.36 8.96,22.36 8.94,22.34 6.86,22.34 6.48,21.96 6.48,20.18 6.18,19.88 FPC2.7
RES3: length 9.8
  Top Layer w0.254: 14.93,8.95 14.93,11.49 15.11,11.67 15.57,11.67 L21.2 ; FPC5.7 17.44,6.29 17.15,6.59 15.49,6.59 14.99,7.1 14.99,8.93 ANCHOR3.2
RESET: length 59.3
  Top Layer w0.254: C6.2 13.98,45.73 R3.2 14.61,45.7 15.37,44.94 15.37,41.39 15.88,40.88 15.88,38.72 16.26,38.34 v1(17.54,38.34) ; v1(35.59,8.37) 35.59,9.51 36.92,10.85 Q2.2
  Bottom Layer w0.254: v1(17.54,38.34) 16.13,38.34 14.99,37.2 14.99,26.4 16.38,25 20.32,25 35.59,9.74 v1(35.59,8.37)
RTS: length 17.1
  Top Layer w0.254: v1(44.32,24.24) 44.32,24.11 43.89,23.68 43.89,23.14 U7.19 ; v1(42.31,13.19) 40.89,13.19 40.26,12.56 40.26,11.81 Q2.3
  GND w0.254: v1(42.31,13.19) 42.31,13.81 42.09,14.03 42.09,20.99 44.32,23.23 v1(44.32,24.24)
RX2: length 40.8
  Top Layer w0.254: H1.7 17.21,52.52 17.21,50.34 18.67,48.88 38.86,48.88 40.01,47.74 40.01,42.02 39.37,41.39 39.37,38.97 38.74,38.34 35.76,38.34 35.63,38.21
RXD: length 21.9
  Top Layer w0.254: U7.21 43.36,21.65 42.8,22.21 42.8,33.9 40.52,36.18 37.34,36.18 36.96,35.8 35.54,35.8
SCL: length 20.4
  Top Layer w0.254: U25.19 32,11.47 32.25,11.22 33.39,11.22 35.81,13.64 35.81,15.42 33.12,18.12 33.12,24.47 34.29,25.64 35.54,25.64
SDA: length 22.5
  Top Layer w0.254: U25.20 32.68,11.9 33.37,11.9 35.31,13.84 35.31,15.22 32.62,17.91 32.62,27.99 34.08,29.45 U4.29
TX2: length 46
  Top Layer w0.254: H1.9 19.81,52.46 19.81,50.28 20.57,49.51 39.37,49.51 42.8,46.09 42.8,38.34 42.16,37.7 39.03,37.7 v1(38.98,37.75)
  Bottom Layer w0.254: v1(35.54,34.53) 36.96,34.53 38.99,36.56 38.99,37.74 v1(38.98,37.75)
TXD: length 21.8
  Top Layer w0.254: U4.35 36.83,37.07 37.34,36.56 40.64,36.56 43.3,33.9 43.3,22.4 43.55,22.15 U7.20
$1N4161: length 2
  Top Layer w0.254: R7.2 45.01,13.19 Q1.1
$1N4165: length 9.9
  Top Layer w0.254: Q2.1 38.35,12.86 38.35,13.19 39.75,14.59 42.8,14.59 43.31,14.08 43.31,11.54 42.93,11.16 R8.2
$1N4516: length 14.4
  Top Layer w0.254: R17.1 41.53,21.07 42.67,19.92 v1(42.67,18.27)
  GND w0.254: v1(42.67,18.27) 43.18,17.76 43.18,8.98 v1(42.57,8.37)
$1N4693: length 2.6
  Top Layer w0.254: C2.2 47,25.61 47,24.89 46.13,24.01 U7.16
$1N5317: length 3.2
  Top Layer w0.254: 41.01,42.4 41.11,42.5 LED1.1
$1N7198: length 3.2
  Top Layer w0.254: 35.42,39.61 36.96,39.61 37.47,40.12 L2.2
$1N7239: length 2.8
  Top Layer w0.254: 35.81,31.99 L3.2
$1N7321: length 3.6
  Top Layer w0.254: L5.2 37.85,29.58 36.7,30.72 35.54,30.72
$1N7526: length 36.1
  Bottom Layer w0.254: v1(17.54,31.99) 26.8,31.99 31.88,26.91 49.47,26.91 v1(50.92,28.36)
$1N7567: length 35.5
  Bottom Layer w0.254: v1(17.54,30.85) 27.18,30.85 32.19,25.83 v1(50.92,25.83)
$1N7608: length 37.3
  Bottom Layer w0.254: v1(50.67,19.24) 50.31,19.59 28.27,19.59 18.52,29.35 v1(17.54,29.35)
$1N7649: length 38.3
  Bottom Layer w0.254: v1(50.67,16.7) 49.99,16.7 49.45,16.16 30.8,16.16 18.79,28.18 v1(17.54,28.18)
$1N7776: length 9.1
  Top Layer w0.254: U11.4 U11.2 47.24,39.15 BEAD.2
$1N14853: length 6.7
  Bottom Layer w0.254: DATOS CAMARA.1 54.25,10.8 53.47,10.02 51.56,10.02 50.92,10.66 v1(50.44,10.66)
$1N14860: length 6
  Bottom Layer w0.254: DATOS CAMARA.2 53.07,12.8 52.45,12.18 52.45,10.7 v1(52.39,10.64)
$1N28858: length 44.8
  Top Layer w0.254: R18.1 R19.2
  Bottom Layer w0.254: v1(50.62,23.48) 51.87,24.73 51.87,28.77 51.69,28.95 32.12,28.95 26.54,34.53 v1(17.54,34.53)
$1N28910: length 10.5
  Top Layer w0.254: U4.7 16.03,33.26 15.78,33.51 15.78,37.8 15.01,38.57 15.01,40.47 14.48,41.01 L9.1
$1N28914: length 10.7
  Top Layer w0.254: L8.1 13.34,20.18 13.08,20.43 13.08,24.62 15.37,26.91 U4.12
$1N29120: length 41.4
  Top Layer w0.254: U25.9 31,16.87 30.36,17.5 v1(26.36,17.5)
  Bottom Layer w0.254: v1(13.77,33.64) 13.77,23.9 23.08,14.59 26.92,14.59 28.45,13.07 29.08,13.07 29.46,13.45 29.46,14.84 26.81,17.5 v1(26.36,17.5)
$1N29124: length 19.2
  Top Layer w0.254: L4.2 13.92,15.43 15.24,16.75 30.23,16.75 30.5,16.48 U25.10
$1N29133: length 4.9
  Top Layer w0.254: L19.2 25.6,14.03 26.65,15.08 U25.11
$1N29232: length 38.9
  Top Layer w0.254: U25.13 28.7,14.08 v1(28.32,14.46)
  Bottom Layer w0.254: v1(13.92,43.42) 14.36,42.98 14.36,23.98 23.11,15.22 27.56,15.22 v1(28.32,14.46)
$1N29236: length 21.2
  Top Layer w0.254: U25.14 29.49,13.57 27.94,13.57 27.64,13.88 v1(26.67,13.88)
  Bottom Layer w0.254: v1(26.67,13.88) 26.67,12.81 26.16,12.3 24.44,12.3 v1(14.03,22.72)
$1N29241: length 15.6
  Top Layer w0.254: L21.1 16.38,15.48 16.89,15.99 20.9,15.99 23.8,13.08 U25.15
$1N35948: length 8.8
  GND w0.254: v1(18.83,14.62) 19.3,15.1 19.3,21.19 18.67,21.83 v1(17.54,21.83)

## Copper pours and planes (outline as drawn; the poured copper is in the pictures)
+3V3 on PWR: 0,55.99 65.02,55.99 65.02,-0.02 0,-0.02
+5V on Bottom Layer: 10.92,12.36 13.08,12.36 13.08,10.23 10.92,10.23
+5V on PWR: 48.88,46.23 63.73,46.23 64.14,45.83 64.14,1.76 64.26,1.64 63.17,0.55 5.67,0.55 5.67,11.94 11.2,17.47 40.73,17.47 48.64,25.38 48.64,45.99
GND on Top Layer: 0,55.99 65.02,55.99 65.02,-0.02 0,-0.02
GND on Bottom Layer: 0,55.99 65.02,55.99 65.02,-0.02 0,-0.02
GND on GND: 0,55.99 64.9,55.99 64.9,-0.14 0,-0.14

Small or netless copper shapes (teardrops, artwork), in the pictures only: 198 on Top Layer, 31 on Bottom Layer, 23 on GND, 8 on PWR

## Text on the board
Bottom Silkscreen Layer: D+ | D-
Top Silkscreen Layer: 5V
